# Altium project PCB_Project.PrjPcb
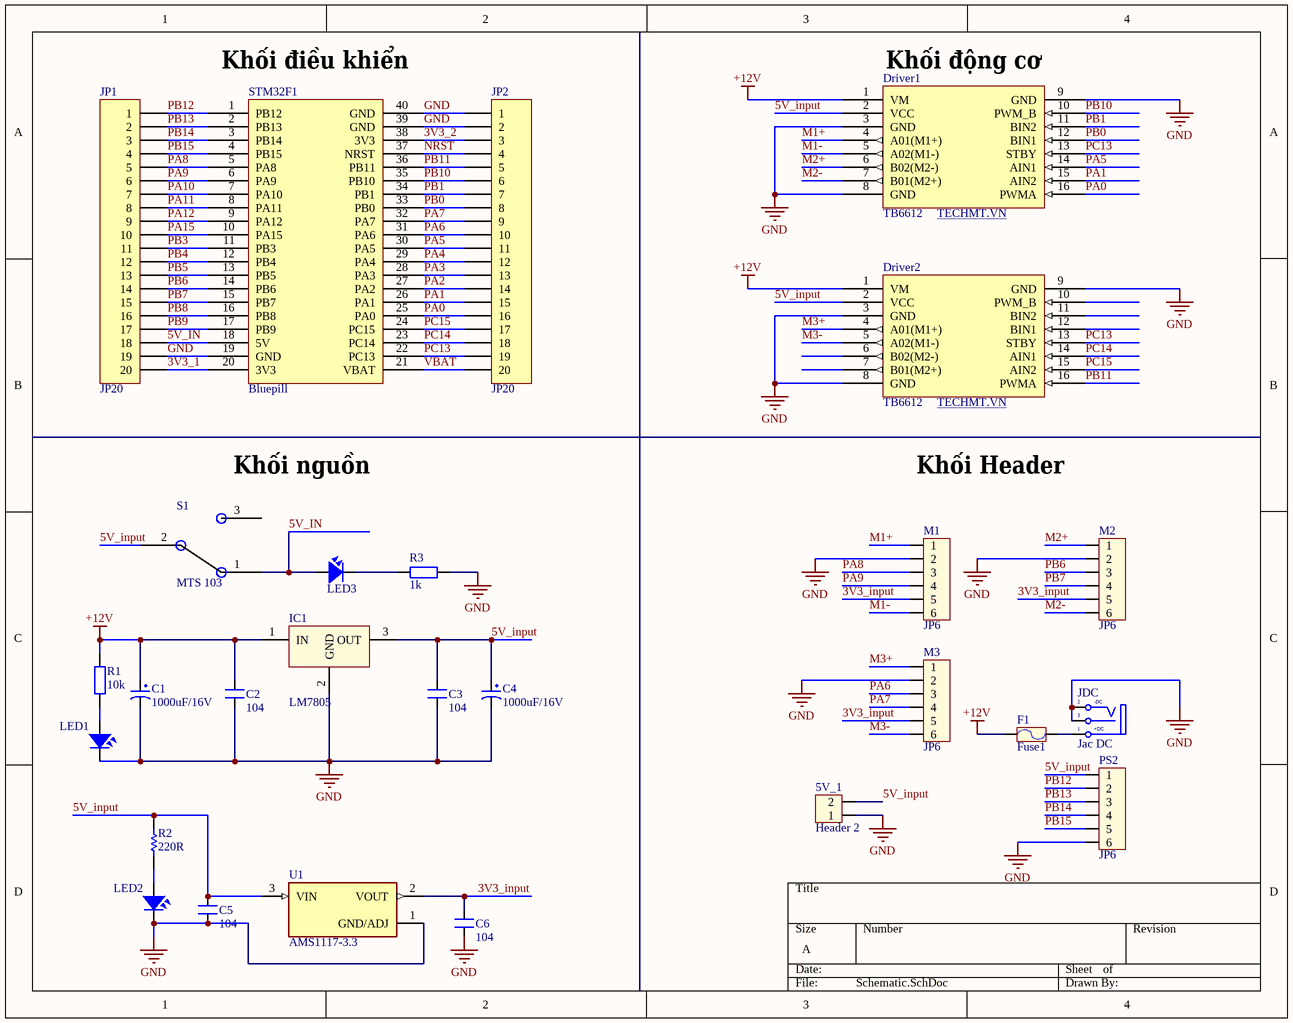
[diagram p0: Schematic.SchDoc]
1 sheet, 27 parts. Net scope: global (net labels, ports and power ports of the same name join across sheets).
Board file: Connection_PCB.PcbDoc

## Sheet Schematic.SchDoc
size A; SheetNumber: 1; SheetTotal: 1

### Parts
5V_1  Header 2  [HED2]
C1  1000uF/16V  [CP1.5/3.4]
C2  104  [CN2]
C3  104  [CN2]
C4  1000uF/16V  [CP1.5/3.4]
C5  104  [CN2]
C6  104  [CN2]
Driver1  TB6612  WEB: TECHMT.VN  [TB6612]
Driver2  TB6612  WEB: TECHMT.VN  [TB6612]
F1  Fuse1  [Fuse1]
IC1  LM7805  [QTO-220]
JDC  Jac DC  [DC-IN]
JP1  JP20  [JP20-D1T]
JP2  JP20  [JP20-D1T]
LED1  LED  [LED-3]  (value not drawn)
LED2  LED  [LED-3]  (value not drawn)
LED3  LED  [LED-3]  (value not drawn)
M1  JP6  [CON_6P]
M2  JP6  [CON_6P]
M3  JP6  [CON_6P]
PS2  JP6  [CON_6P]
R1  10k  [R1/4W]
R2  value 220R  [R1/4W]  (hidden comment: Res1)
R3  1k  [R1/4W]
S1  MTS 103  [MTS 103]
STM32F1  Bluepill  [Blue Pill]
U1  AMS1117-3.3  [SOT229P700X180-4N]

### Nets
+12V: C1.1 C2.2 Driver1.1(VM) Driver2.1(VM) F1.1 IC1.1(IN) R1.2
GND: 5V_1.1 C1.2 C2.1 C3.1 C4.2 C5.1 C6.1 Driver1.3(GND) Driver1.8(GND) Driver1.9(GND) Driver2.3(GND) Driver2.8(GND) Driver2.9(GND) IC1.2(GND) JDC.2(TN) JDC.3(S) JP1.19 JP2.1 JP2.2 LED1.2 LED2.2 M1.2 M2.2 M3.2 PS2.6 R3.2 STM32F1.19(GND) STM32F1.39(GND) STM32F1.40(GND) U1.1(GND/ADJ)
3V3_1: JP1.20 STM32F1.20(3V3)
3V3_2: JP2.3 STM32F1.38(3V3)
3V3_input: C6.2 M1.5 M2.5 M3.5 U1.2(VOUT)
5V_IN: JP1.18 LED3.1 S1.1 STM32F1.18(5V)
5V_input: 5V_1.2 C3.2 C4.1 C5.2 Driver1.2(VCC) Driver2.2(VCC) IC1.3(OUT) PS2.1 R2.2 S1.2 U1.3(VIN)
M1+: Driver1.4(A01(M1+)) M1.1
M1-: Driver1.5(A02(M1-)) M1.6
M2+: Driver1.6(B02(M2-)) M2.1
M2-: Driver1.7(B01(M2+)) M2.6
M3+: Driver2.4(A01(M1+)) M3.1
M3-: Driver2.5(A02(M1-)) M3.6
NRST: JP2.4 STM32F1.37(NRST)
PA0: Driver1.16(PWMA) JP2.16 STM32F1.25(PA0)
PA1: Driver1.15(AIN2) JP2.15 STM32F1.26(PA1)
PA2: JP2.14 STM32F1.27(PA2)
PA3: JP2.13 STM32F1.28(PA3)
PA4: JP2.12 STM32F1.29(PA4)
PA5: Driver1.14(AIN1) JP2.11 STM32F1.30(PA5)
PA6: JP2.10 M3.3 STM32F1.31(PA6)
PA7: JP2.9 M3.4 STM32F1.32(PA7)
PA8: JP1.5 M1.3 STM32F1.5(PA8)
PA9: JP1.6 M1.4 STM32F1.6(PA9)
PA10: JP1.7 STM32F1.7(PA10)
PA11: JP1.8 STM32F1.8(PA11)
PA12: JP1.9 STM32F1.9(PA12)
PA15: JP1.10 STM32F1.10(PA15)
PB0: Driver1.12(BIN1) JP2.8 STM32F1.33(PB0)
PB1: Driver1.11(BIN2) JP2.7 STM32F1.34(PB1)
PB3: JP1.11 STM32F1.11(PB3)
PB4: JP1.12 STM32F1.12(PB4)
PB5: JP1.13 STM32F1.13(PB5)
PB6: JP1.14 M2.3 STM32F1.14(PB6)
PB7: JP1.15 M2.4 STM32F1.15(PB7)
PB8: JP1.16 STM32F1.16(PB8)
PB9: JP1.17 STM32F1.17(PB9)
PB10: Driver1.10(PWM_B) JP2.6 STM32F1.35(PB10)
PB11: Driver2.16(PWMA) JP2.5 STM32F1.36(PB11)
PB12: JP1.1 PS2.2 STM32F1.1(PB12)
PB13: JP1.2 PS2.3 STM32F1.2(PB13)
PB14: JP1.3 PS2.4 STM32F1.3(PB14)
PB15: JP1.4 PS2.5 STM32F1.4(PB15)
PC13: Driver1.13(STBY) Driver2.13(STBY) JP2.19 STM32F1.22(PC13)
PC14: Driver2.14(AIN1) JP2.18 STM32F1.23(PC14)
PC15: Driver2.15(AIN2) JP2.17 STM32F1.24(PC15)
VBAT: JP2.20 STM32F1.21(VBAT)
NetF1_2: F1.2 JDC.1(T)
NetLED1_1: LED1.1 R1.1
NetLED2_1: LED2.1 R2.1
NetLED3_2: LED3.2 R3.1

Not connected (* = marked no-connect by the designer): Driver2 6(B02(M2-)) 7(B01(M2+)) 10(PWM_B) 11(BIN2) 12(BIN1); S1 3(5)

### Notes on the sheet
- (near STM32F1) Khối điều khiển
- (near Driver1) Khối động cơ
- (near S1) Khối nguồn
- Khối Header
- (in symbol DCIN) -DC; +DC

### Library data of the parts
5V_1 = Hed2: Header 2 (Green); Value: Header 2
C1 C4 = CP3: Cap 100uF/35V - 470uF/16V; Value: 100uF/35V/50V; Description 1: 1000uF/6,3V - 470uF/16V - 330uF - 25V; Description 2: 220uF/35V - 100uF/50V - 63V - 4,7uF/200V; Description 3: 22uF => 33uF100V - 3,3uF => 4,7uF/250V; Description 4: 2,2uF =>3,3uF/350 - 2,2uF/400V - 1uF/450V
C2 C3 C5 C6 = CN2: Cap np 104 => 105pF; Value: 0.1uF
F1 = Fuse: Designed by: VanDungEvn; Value: Fuse
IC1 = LM78xx: On ap +, from + 5 to + 24VDC; Value: LM7805
JDC = DCIN: Jac DC input; Value: Jac DC
JP1 JP2 = JP20: WR-PHD 2.54 mm Angled Socket Header; Manufacturer: W¨¹rth Elektronik eiSos GmbH; partNo: 613020143121; ComponentLink1 Description: Manufacturer; ComponentLink2 Description: Datasheet; NoPins: 20; Created Date: 29 March 2013; ComponentLink1URL: http://www.we-online.com; ComponentLink2URL: http://katalog.we-online.de/em/datasheet/6130xx143121.pdf; Created by: Karrer Zheng
LED1-LED3 = LED: LED Single colour Green and Red; Value: LED 3 ly Single Colour
M1-M3 PS2 = Con6: Connector 6; Value: Connector 6
R1 R3 = R1/4W: Resistor 1/4W; Value: R1/4W - 1K
R2 = Res1_4: Resistor; Manufacturer: Generic Components; Class: Passive; Published: 08/06/2000; Publisher: Altium Hobart Technology Centre; SubClass: Resistor
STM32F1 = STM32F103C8T6
U1 = AMS1117-3.3: Sot223/Pkg 1-Amp 3.3-Volt Low Drop Out Voltage Regulatator; MF: Advanced Monolithic Systems; Value: *; SnapEDA_Link: https://www.snapeda.com/parts/AMS1117-3.3/Advanced+Monolithic+Systems/view-part/?ref=snap; Availability: Not in stock; Price: None; Package: SOT-223 Seeed Technology; Check_prices: https://www.snapeda.com/parts/AMS1117-3.3/Advanced+Monolithic+Systems/view-part/?ref=eda; MP: AMS1117-3.3